# EAGLE design inverter (EAGLE 6.6.0)
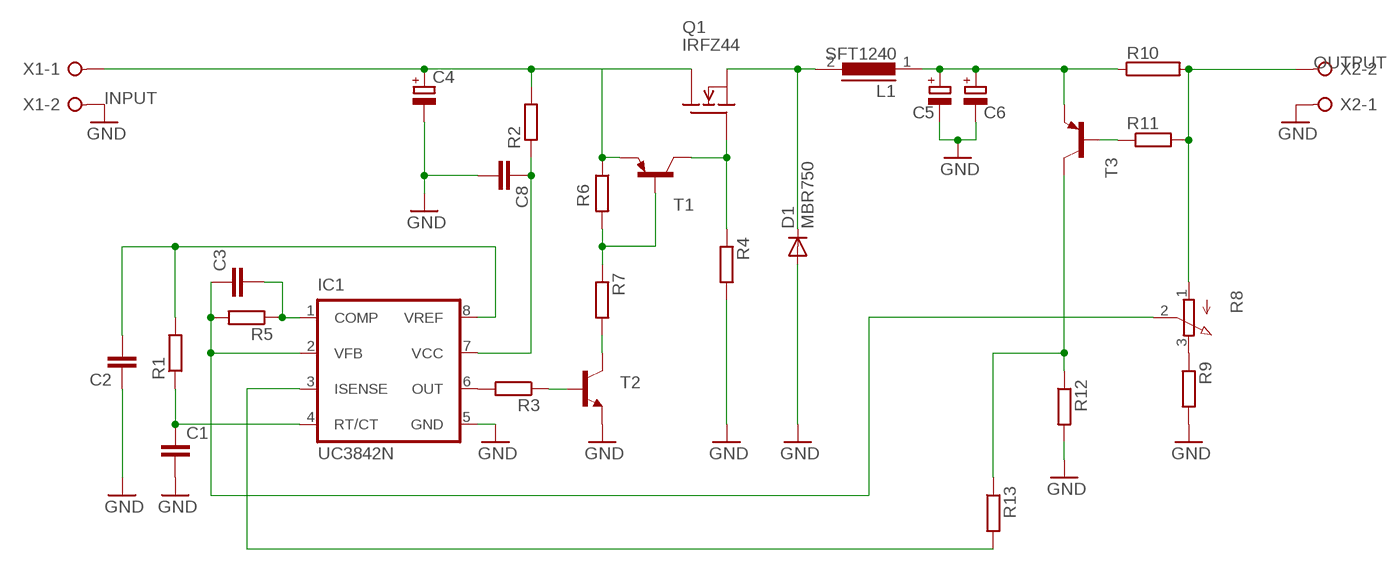
[diagram p0: schematic, sheet 1]

## Parts
C1  C-EU050-024X044  [C050-024X044]
C2  C-EU050-025X075  [C050-025X075]
C3  C-EU050-024X044  [C050-024X044]
C4  CPOL-EUE5-8.5  [E5-8,5]
C5  CPOL-EUE5-8.5  [E5-8,5]
C6  CPOL-EUE5-8.5  [E5-8,5]
C8  C-EU050-025X075  [C050-025X075]
D1  MBR750  [TO220AC]
IC1  UC3842N  [DIL08]
L1  SFT1240  [SFT1240]
Q1  IRFZ44  IRF540  [TO220]
R1  R-EU_0207/10  [0207/10]
R2  R-EU_0207/10  [0207/10]
R3  R-EU_0207/10  [0207/10]
R4  R-EU_0207/10  [0207/10]
R5  R-EU_0207/10  [0207/10]
R6  R-EU_0207/10  [0207/10]
R7  R-EU_0207/10  [0207/10]
R8  3RP/1610N  [3RP/1610N]
R9  R-EU_0207/10  [0207/10]
R10  RKH208-8  [KH208-8]
R11  R-EU_0207/10  [0207/10]
R12  R-EU_0207/10  [0207/10]
R13  R-EU_0207/10  [0207/10]
T1  BC557A-PNP-TO92-EBC  [TO92-EBC]
T2  BC547-NPN-TO92-CBE  [TO92-CBE]
T3  BC557A-PNP-TO92-EBC  [TO92-EBC]
X1  W237-02P  [W237-132]
X2  W237-02P  [W237-132]

## Nets
GND: C1.2 C2.1 C4.- C5.- C6.- C8.2 D1.A IC1.5(GND) R4.2 R9.2 R12.2 T2.E X1.2 X2.1
N$1: IC1.6(OUT) R3.2
N$2: Q1.1(G) R4.1 T1.C
N$3: D1.C L1.2 Q1.3(S)
N$4: C2.2 IC1.8(VREF) R1.2
N$5: C1.1 IC1.4(RT/CT) R1.1
N$6: C3.1 IC1.2(VFB) R5.2 R8.2(S)
N$7: C3.2 IC1.1(COMP) R5.1
N$8: C8.1 IC1.7(VCC) R2.1
N$9: C4.+ Q1.2(D) R2.2 R6.1 T1.E X1.1
N$10: R3.1 T2.B
N$11: R7.2 T2.C
N$12: R6.2 R7.1 T1.B
N$13: R8.1(A) R10.2 R11.2 X2.2
N$14: R8.3(E) R9.1
N$15: C5.+ C6.+ L1.1 R10.1 T3.E
N$16: R11.1 T3.B
N$17: IC1.3(ISENSE) R13.2
N$19: R12.1 R13.1 T3.C

## Notes on the sheet
- OUTPUT
- INPUT

## Library data of the parts
C1-C3 C8 = rcl:C-EU: CAPACITOR, European symbol
C4-C6 = rcl:CPOL-EU: POLARIZED CAPACITOR, European symbol
D1 = diode:MBR750: DIODE barrier rectifier, 7.5 A, 50 V
IC1 = v-reg:UC384*: SMPS Controller Source: http://www.fairchildsemi.com/ds/UC/UC3843.pdf
L1 = inductors:SFT1240: INDUCTOR
Q1 = transistor-fet:IRF540: N-Channel Enhancement MOSFET (HEXFET); 100V; 28A; 0,077Ohm
R1-R7 R9 R11-R13 = rcl:R-EU_: RESISTOR, European symbol
R8 = pot:3RP/1610N: 16mm Potentiometer one level Source: http://www.alphapotentiometers.net/html/16mm_pot_2.html
R10 = resistor-power:R: Power Resitor; OC_FARNELL: unknown; OC_NEWARK: unknown
T1 T3 = transistor:*-PNP-: PNP Transistror
T2 = transistor:*-NPN-: NPN Transistror BF959 corrected 2008.03.06
X1 X2 = con-wago-508:W237-02P: WAGO SREW CLAMP; OC_FARNELL: unknown; OC_NEWARK: unknown

## Board
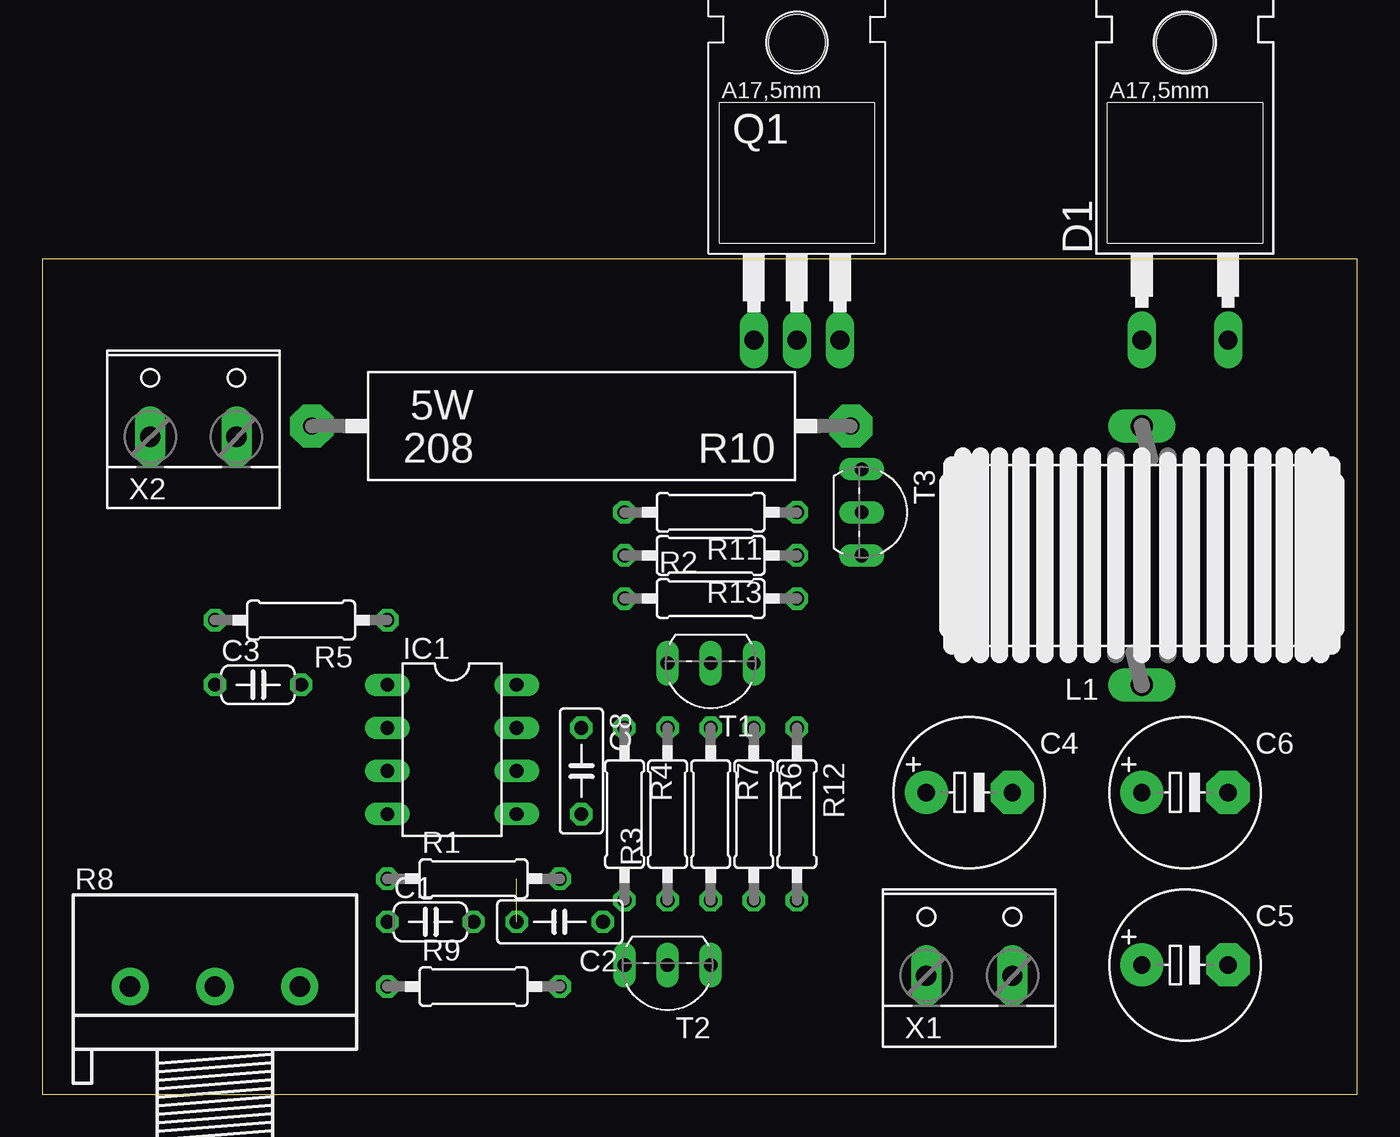
[diagram p1: board, top side]
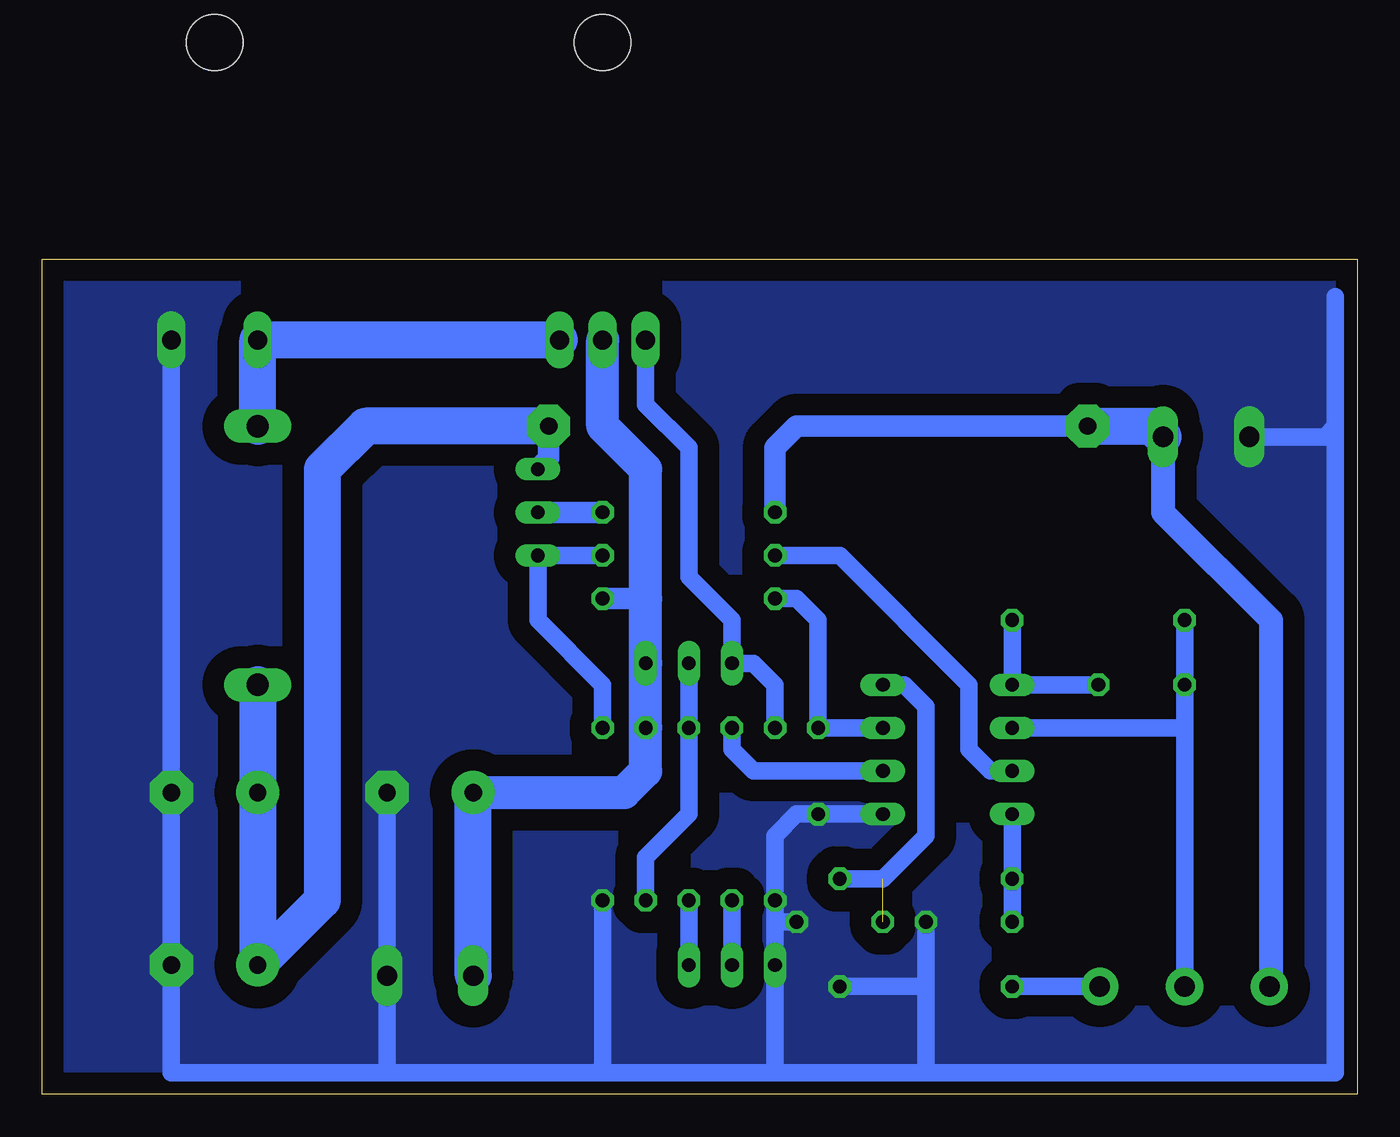
[diagram p2: board, bottom side, seen from below]

Size 77.45 x 49.2 mm. Coordinates in mm from the lower left corner, seen from the top.
Outline: 0,0 77.45,0 77.45,49.2 0,49.2 0,0
Copper layers (1*16): Top 0.035mm / dielectric 1.5mm / Bottom 0.035mm
Design rules "default": minimum track width 10mil, minimum drill 24mil, track to track 8mil, track to pad 8mil, pad to pad 8mil, via to via 8mil, smd to smd 8mil, copper to edge 40mil, drill to drill 8mil, minimum pad ring 10mil, minimum via ring 8mil, stop-mask expansion 4mil, vias tented up to drill 0mil, thermal gap 10mil

### Footprints (pad centres in the part's own frame; a part is rotated, then mirrored left to right if it is on the bottom)
C050-024X044 = drill 0.813 octagon: 1 -2.54,0; 2 2.54,0
C050-025X075 = drill 0.813 octagon: 1 -2.54,0; 2 2.54,0
E5-8,5 = drill 1.016 pad 2.54: + -2.54,0 | drill 1.016 pad 2.54 octagon: - 2.54,0
TO220AC = drill 1.118 long: A 2.54,-6.35; C -2.54,-6.35 | hole 3.302: 0,11.176
DIL08 = drill 0.813 long: 1 -3.81,-3.81; 2 -1.27,-3.81; 3 1.27,-3.81; 4 3.81,-3.81; 5 3.81,3.81; 6 1.27,3.81; 7 -1.27,3.81; 8 -3.81,3.81
SFT1240 = drill 1.321 long: 1 -7.62,0; 2 7.62,0
TO220 = drill 1.118 long: 1 -2.54,-6.35; 2 0,-6.35; 3 2.54,-6.35 | hole 3.302: 0,11.176
0207/10 = drill 0.813 octagon: 1 -5.08,0; 2 5.08,0
3RP/1610N = drill 1.2 pad 2.184: 1 -5,0; 2 0,0; 3 5,0
KH208-8 = drill 1.016 pad 2.54 octagon: 1 -15.875,0; 2 15.875,0
TO92-EBC = drill 0.813 long: B 0,-1.27; C 2.54,-1.27; E -2.54,-1.27
TO92-CBE = drill 0.813 long: B 0,0; C -2.54,0; E 2.54,0
W237-132 = drill 1.194 long: 1 -2.54,-0.635; 2 2.54,-0.635

### Placement (x,y rotation side)
C1  22.86,10.16 0 top
C2  30.48,10.16 180 top
C3  12.7,24.13 0 top
C4  54.61,17.78 0 top
C5  67.31,7.62 0 top
C6  67.31,17.78 0 top
C8  31.75,19.05 270 top
D1  67.31,50.8 0 top
IC1  24.13,20.32 270 top
L1  64.77,31.75 90 top
Q1  44.45,50.8 0 top
R1  25.4,12.7 0 top
R2  39.37,29.21 0 top
R3  36.83,16.51 90 top
R4  34.29,16.51 270 top
R5  15.24,27.94 180 top
R6  41.91,16.51 270 top
R7  39.37,16.51 270 top
R8  10.16,6.35 0 top
R9  25.4,6.35 0 top
R10  31.75,39.37 180 top
R11  39.37,34.29 180 top
R12  44.45,16.51 270 top
R13  39.37,31.75 180 top
T1  39.37,24.13 180 top
T2  36.83,7.62 180 top
T3  49.53,34.29 270 top
X1  54.61,7.62 0 top
X2  8.89,39.37 0 top

### Tracks (layer width: path | path; a pad name or v marks a point on that pad's centre or on a via)
GND
  Bottom 1.016: 25.4,1.27 1.27,1.27 1.27,39.37 | 25.4,1.27 34.29,1.27 | 34.29,1.27 44.45,1.27 | 44.45,1.27 57.15,1.27 | 57.15,1.27 69.85,1.27 C5.- | 34.29,10.16 T2.E 34.29,1.27 | 34.29,10.16 R4.2 34.29,15.24 33.02,16.51 C8.2 IC1.5 | 1.27,46.99 1.27,39.37 | C4.- 57.15,1.27 | 69.85,11.43 C5.- | D1.A C6.- C5.- | C1.2 25.4,6.35 | 25.4,6.35 25.4,1.27 | R9.2 25.4,6.35 | C2.1 34.29,10.16 | R12.2 44.45,1.27 | X2.1 1.91,38.73 1.27,39.37
  pour Bottom (isolate 1.27, no thermals): -3.81,50.8 81.28,50.8 81.28,-5.08 -3.81,-2.54
N$1
  Bottom 1.016: R3.2 36.83,20.32 35.56,19.05 IC1.6
N$2
  Bottom 1.016: R4.1 34.29,24.13 35.56,25.4 T1.C 36.83,27.94 39.37,30.48 39.37,38.1 41.91,40.64 Q1.1
N$3
  Bottom 2.184: L1.2 D1.C Q1.3
N$4  (1 unrouted)
  Bottom 1.016: R1.2 27.94,12.7 25.4,15.24 25.4,22.86 26.67,24.13 IC1.8
N$5
  Bottom 1.016: R1.1 IC1.4 C1.1
N$6
  Bottom 1.016: R5.2 C3.1 10.16,21.59 | IC1.2 10.16,21.59 | R8.2 10.16,21.59
N$7
  Bottom 1.016: R5.1 IC1.1 C3.2
N$8
  Bottom 1.016: R2.1 33.02,29.21 31.75,27.94 C8.1 IC1.7
N$9
  Bottom 1.27: R2.2 41.91,29.21
  Bottom 1.93: C4.+ 43.18,17.78 41.91,19.05 R6.1 T1.E 41.91,29.21 41.91,36.83 44.45,39.37 Q1.2
  Bottom 2.184: X1.1 C4.+
N$10
  Bottom 1.016: T2.B R3.1
N$11
  Bottom 1.016: T2.C R7.2
N$12
  Bottom 1.016: R6.2 41.91,13.97 39.37,16.51 R7.1 T1.B
N$13
  Bottom 1.27: R11.2 34.29,38.1 33.02,39.37 R10.2
  Bottom 1.422: X2.2 11.43,34.29 5.08,27.94 5.08,6.43 R8.1
  Bottom 2.184: R10.2 12.06,39.37 X2.2
N$14
  Bottom 1.016: R9.1 R8.3
N$15
  Bottom 1.27: R10.1 47.62,37.47 T3.E
  Bottom 2.184: R10.1 58.42,39.37 60.96,36.83 60.96,11.43 C5.+ C6.+ L1.1
N$16
  Bottom 1.27: T3.B R11.1
N$17
  Bottom 1.016: R13.2 30.48,31.75 22.86,24.13 22.86,20.32 21.59,19.05 IC1.3
N$19
  Bottom 1.016: R13.1 T3.C 48.26,27.94 44.45,24.13 R12.1